# EAGLE design trafoboard (EAGLE 8.4.0)
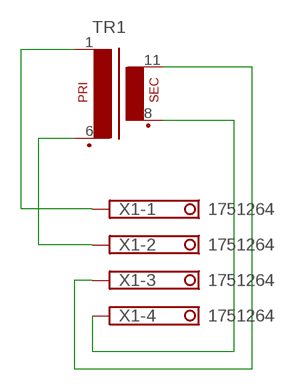
[diagram p0: schematic, sheet 1]

## Parts
TR1  EI48-1  [EI48-1]
X1  1751264  [1751264]

## Nets
N$1: TR1.1 X1.1
N$2: TR1.6(P2) X1.2
N$3: TR1.8(S3) X1.4
N$4: TR1.11(S4) X1.3

## Library data of the parts
TR1 = trafo:EI48-1: TRANSFORMER 1 primary winding, 1 secondary winding ERA
X1 = con-phoenix-350:1751264: MKDS 1/ 4-3,5 Printklemme Nennstrom: 10 A Bemessungsspannung: 160 V Raster: 3,5 mm Polzahl: 4 Montageart: Löten Anschlussart: Schraubanschluss Anschlussrichtung vom Leiter zur Platine: 0° Source: http://eshop.phoenixcontact.com .. 1751264.pdf; MPN: 1751264; OC_FARNELL: unknown; OC_NEWARK: 10R0934

## Board
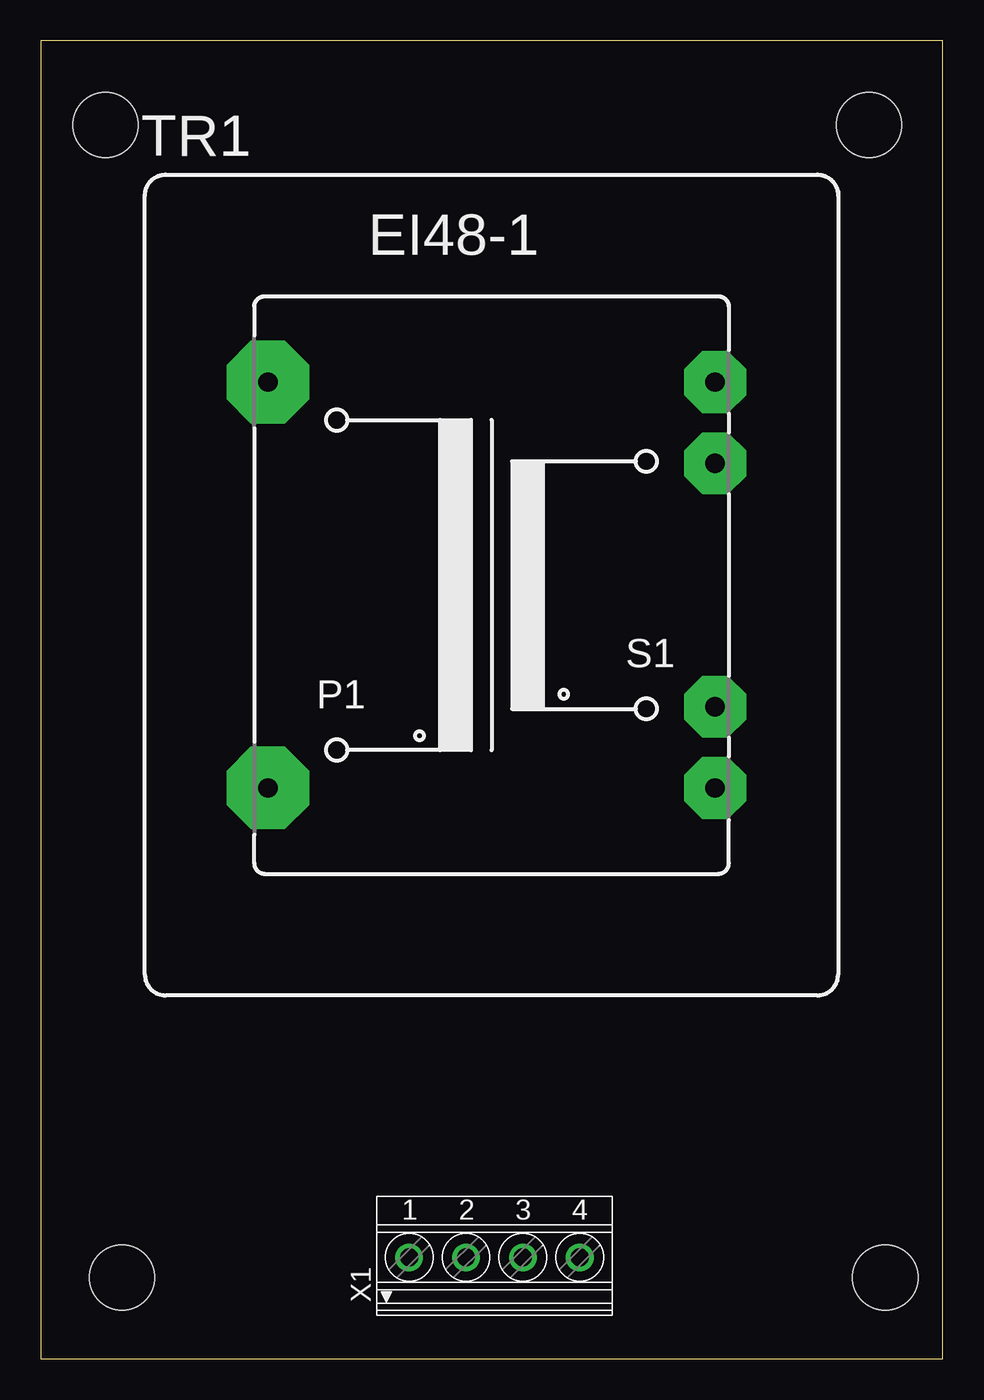
[diagram p1: board, top side]
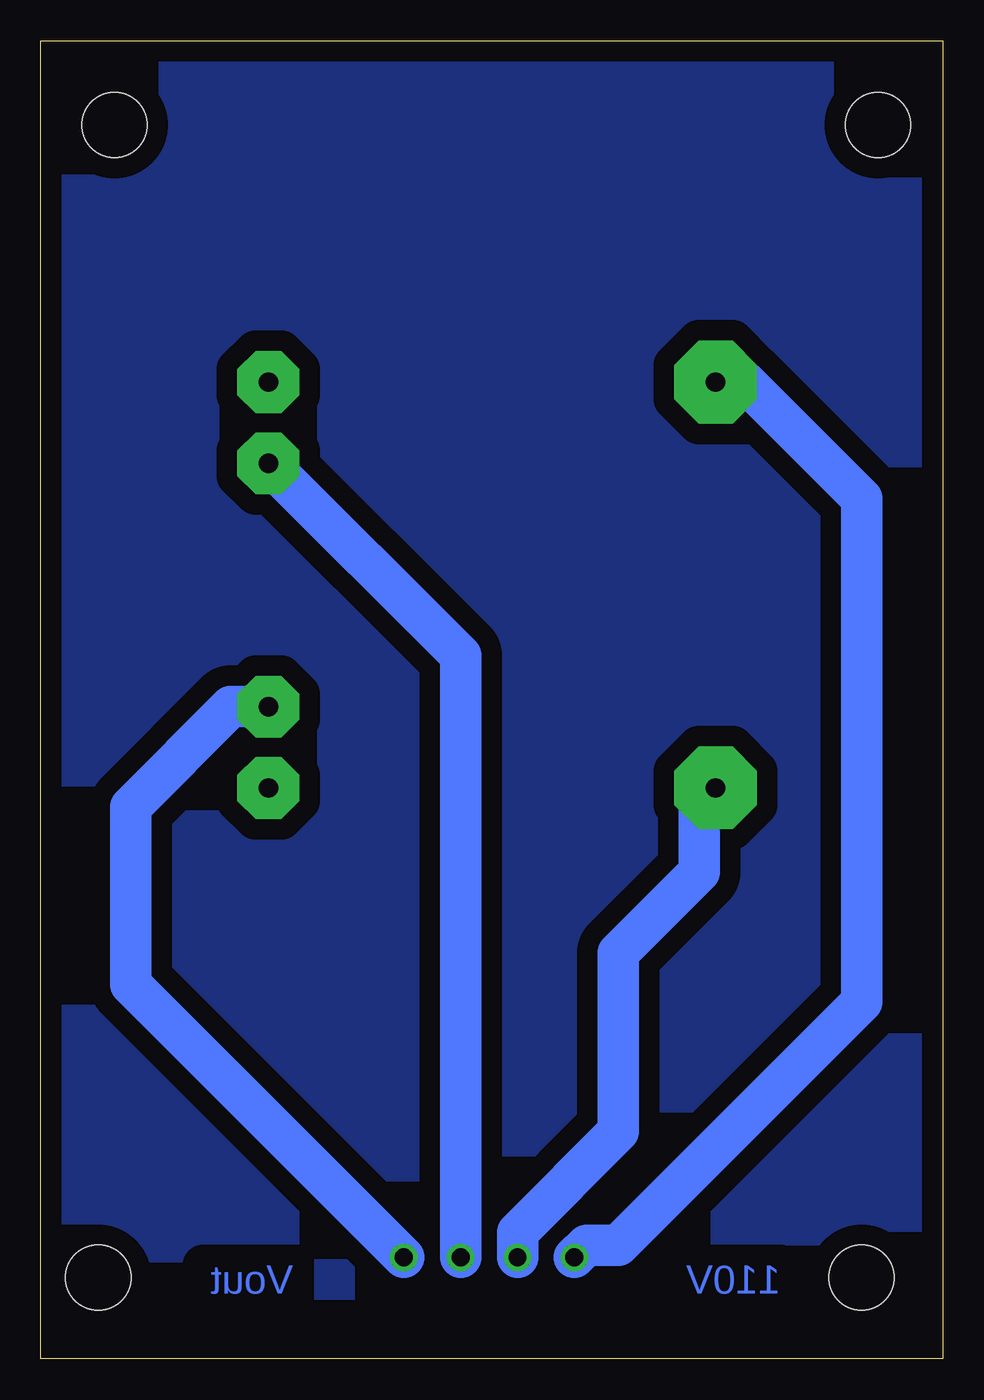
[diagram p2: board, bottom side, seen from below]

Size 55.55 x 81.19 mm. Coordinates in mm from the lower left corner, seen from the top.
Outline: 0,0 55.55,0 55.55,81.19 0,81.19 0,0
Copper layers (1*16): Top 0.035mm / dielectric 1.5mm / Bottom 0.035mm
Design rules "default": minimum track width 6mil, minimum drill 0.35mm, track to track 6mil, track to pad 6mil, pad to pad 6mil, via to via 6mil, smd to smd 6mil, copper to edge 40mil, drill to drill 6mil, minimum pad ring 10mil, minimum via ring 8mil, stop-mask expansion 4mil, vias tented up to drill 0mil, thermal gap 10mil
Holes 4 mm at 5,5 52,5 4,76 51,76

### Footprints (pad centres in the part's own frame; a part is rotated, then mirrored left to right if it is on the bottom)
EI48-1 = drill 1.194 pad 5.08 octagon: 1 -13.767,12.497; 6 -13.767,-12.497 | drill 1.194 pad 3.81 octagon: 7 13.767,-12.497; 8 13.767,-7.493; 11 13.767,7.493; 12 13.767,12.497
1751264 = drill 1.1 pad 1.7: 1 -5.25,-0.1; 2 -1.75,-0.1; 3 1.75,-0.1; 4 5.25,-0.1

### Placement (x,y rotation side)
TR1  27.76,47.66 0 top
X1  27.94,6.35 0 top

### Tracks (layer width: path | path; a pad name or v marks a point on that pad's centre or on a via)
N$1
  Bottom 2.54: TR1.1 12.16,60.16 5,53 5,22 20,7 21.94,7 X1.1
N$2
  Bottom 2.54: X1.2 26.19,7.81 20,14 20,25 15,30 15,34.16 TR1.6
N$3
  Bottom 2.54: TR1.8 43.83,40.17 50,34 50,23.06 X1.4
N$4
  Bottom 2.54: X1.3 29.69,43.32 TR1.11
N$5
  pour Bottom (isolate 1.27, rank 2): 0.15,4.9 55.15,4.9 56,81 0,81

### Text on the board
Bottom: 110V | Vout